# EAGLE design Magnetic switch (EAGLE 5.10)
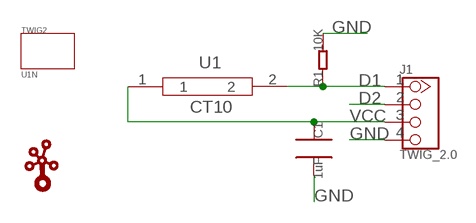
[diagram p0: schematic, sheet 1]

## Parts
C1  1uF  C0805  [0805]
J1  TWIG_2.0  [2.0_1X4]
R1  10K  R0805  [0805]
TWIG2  U1N  [U1N]
U1  MAGNETISM  [MAGNETISM]
U$2  TWIGLOGOTWIGLOGO_SMALL  [TWIGLOGO_SMALL]

## Nets
D1: J1.1 R1.1 U1.2
D2: J1.2
GND: C1.2 J1.4 R1.2
VCC: C1.1 J1.3 U1.1

## Notes on the sheet
- CT10

## Library data of the parts
C1 = CPT_SMD:C0805
J1 = CONNECTER:TWIG_2.0
R1 = CPT_SMD:R0805
TWIG2 = twig_template1:U1N
U1 = seeedleo:MAGNETISM
U$2 = seeedleo:TWIGLOGO

## Board
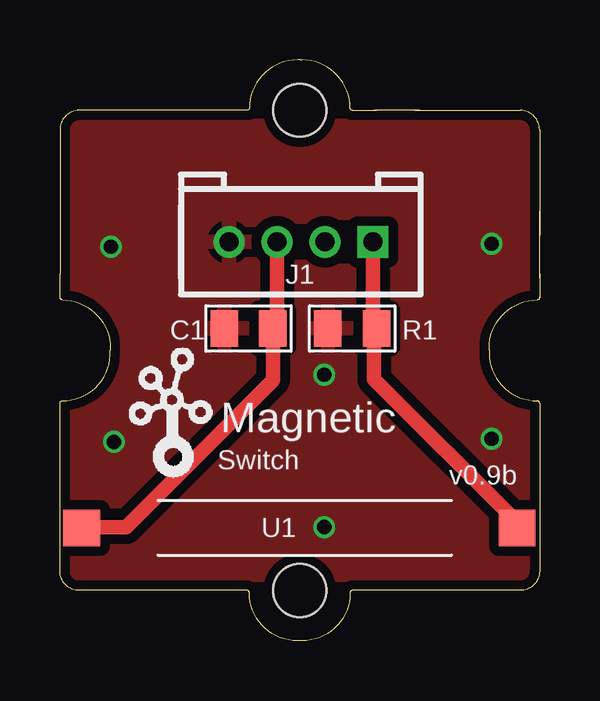
[diagram p1: board, top side]
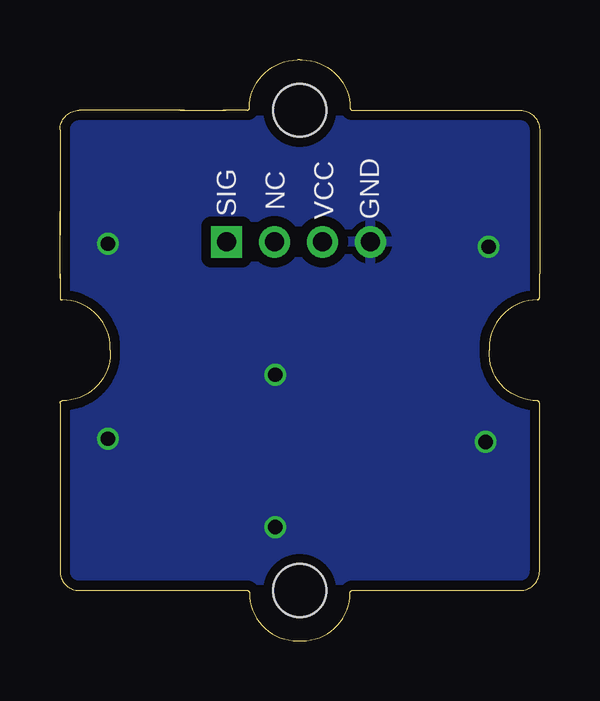
[diagram p2: board, bottom side, seen from below]

Size 20 x 24.2 mm. Coordinates in mm from the lower left corner, seen from the top.
Copper layers (1*16): Top 0.035mm / dielectric 1.5mm / Bottom 0.035mm
Design rules "SeeedStudio_rule_no_angle_090911": minimum track width 6mil, minimum drill 12mil, track to track 6mil, track to pad 6mil, pad to pad 6mil, via to via 6mil, smd to smd 0mil, copper to edge 10mil, drill to drill 10mil, minimum pad ring 10mil, minimum via ring 6mil, stop-mask expansion 2mil, vias tented up to drill 100mil, thermal gap 10mil

### Footprints (pad centres in the part's own frame; a part is rotated, then mirrored left to right if it is on the bottom)
0805 = smd 1.143 x 1.524: 1 -1.016,0; 2 1.016,0
2.0_1X4 = drill 0.8 pad 1.27 square: 1 -3,0 | drill 0.8 pad 1.27 round: 2 -1,0; 3 1,0; 4 3,0
U1N = hole 2.2: 0,-10; 0,10
MAGNETISM = smd 1.524 x 1.524: 1 0.762,0; 2 18.923,0

### Placement (x,y rotation side)
C1  7.87,13.01 180 top
J1  10.05,16.62 180 top
R1  12.18,13.01 180 top
TWIG2  10,12.1 180 top
U1  0.14,4.71 0 top
U$2  2.48,6.69 0 top

### Tracks (layer width: path | path; a pad name or v marks a point on that pad's centre or on a via)
D1
  Top 0.61: J1.1 13.05,13.29 R1.1 13.1,12.79 13.1,10.91 19.07,4.94 U1.2
GND  (via drill 0.6)
  other vias: 18,8.42 2.25,8.29 11.02,11.08 18,16.55 2.13,16.42 11.02,4.73
  pour Top (isolate 0.406): 22.7,-0.73 -1.81,-0.73 -1.81,25.31 22.7,25.31
  pour Bottom (isolate 0.406): 22.57,-0.85 -1.81,-0.85 -1.81,25.44 22.57,25.44
VCC
  Top 0.61: J1.3 9.05,13.06 C1.1 8.88,10.86 2.76,4.73 0.93,4.73 U1.1

### Text on the board
tPlace: Magnetic | Switch | v0.9b
bPlace: GND | VCC | NC | SIG